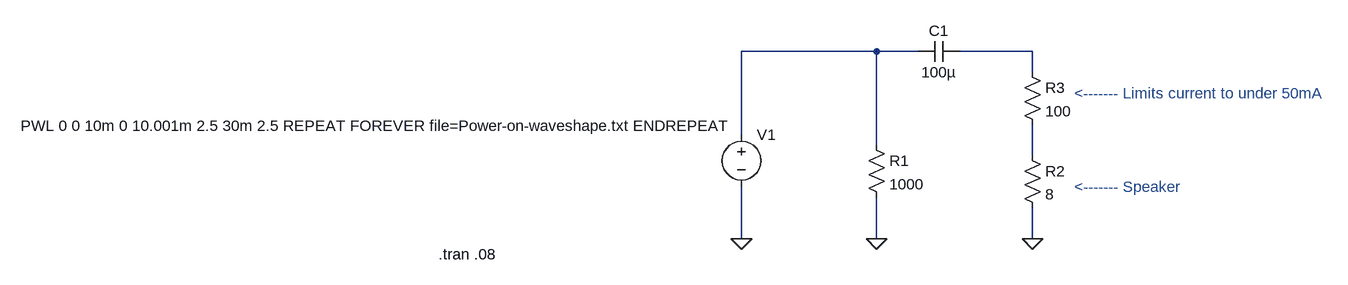
[diagram p0: schematic Output Drive.asc]
Output Drive.asc, the LTspice schematic file:
Version 4
SHEET 1 1060 680
WIRE 288 32 80 32
WIRE 352 32 288 32
WIRE 528 32 416 32
WIRE 528 64 528 32
WIRE 80 160 80 32
WIRE 288 176 288 32
WIRE 528 192 528 144
WIRE 80 320 80 240
WIRE 288 320 288 256
WIRE 528 320 528 272
FLAG 80 320 0
FLAG 288 320 0
FLAG 528 320 0
SYMBOL voltage 80 144 R0
WINDOW 3 -12 2 Right 2
SYMATTR InstName V1
SYMATTR Value PWL 0 0 10m 0 10.001m 2.5 30m 2.5 REPEAT FOREVER file=Power-on-waveshape.txt ENDREPEAT
SYMBOL res 272 160 R0
SYMATTR InstName R1
SYMATTR Value 1000
SYMBOL cap 352 48 R270
WINDOW 0 32 32 VTop 2
WINDOW 3 0 32 VBottom 2
SYMATTR InstName C1
SYMATTR Value 100µ
SYMBOL res 512 176 R0
SYMATTR InstName R2
SYMATTR Value 8
SYMBOL res 512 48 R0
SYMATTR InstName R3
SYMATTR Value 100
TEXT -386 344 Left 2 !.tran .08
TEXT 592 240 Left 2 ;<------- Speaker
TEXT 592 96 Left 2 ;<------- Limits current to under 50mA

The netlist it stands for:
* Output Drive.asc
V1 N001 0 PWL 0 0 10m 0 10.001m 2.5 30m 2.5 REPEAT FOREVER file=Power-on-waveshape.txt ENDREPEAT
R1 N001 0 1000
C1 N001 N002 100µ
R2 N003 0 8
R3 N002 N003 100
.tran .08
* <------- Speaker
* <------- Limits current to under 50mA
.backanno
.end